# Altium schematic sheet RFID Reader.SchDoc
size B; Organization: MASA; SheetNumber: 2; SheetTotal: 7
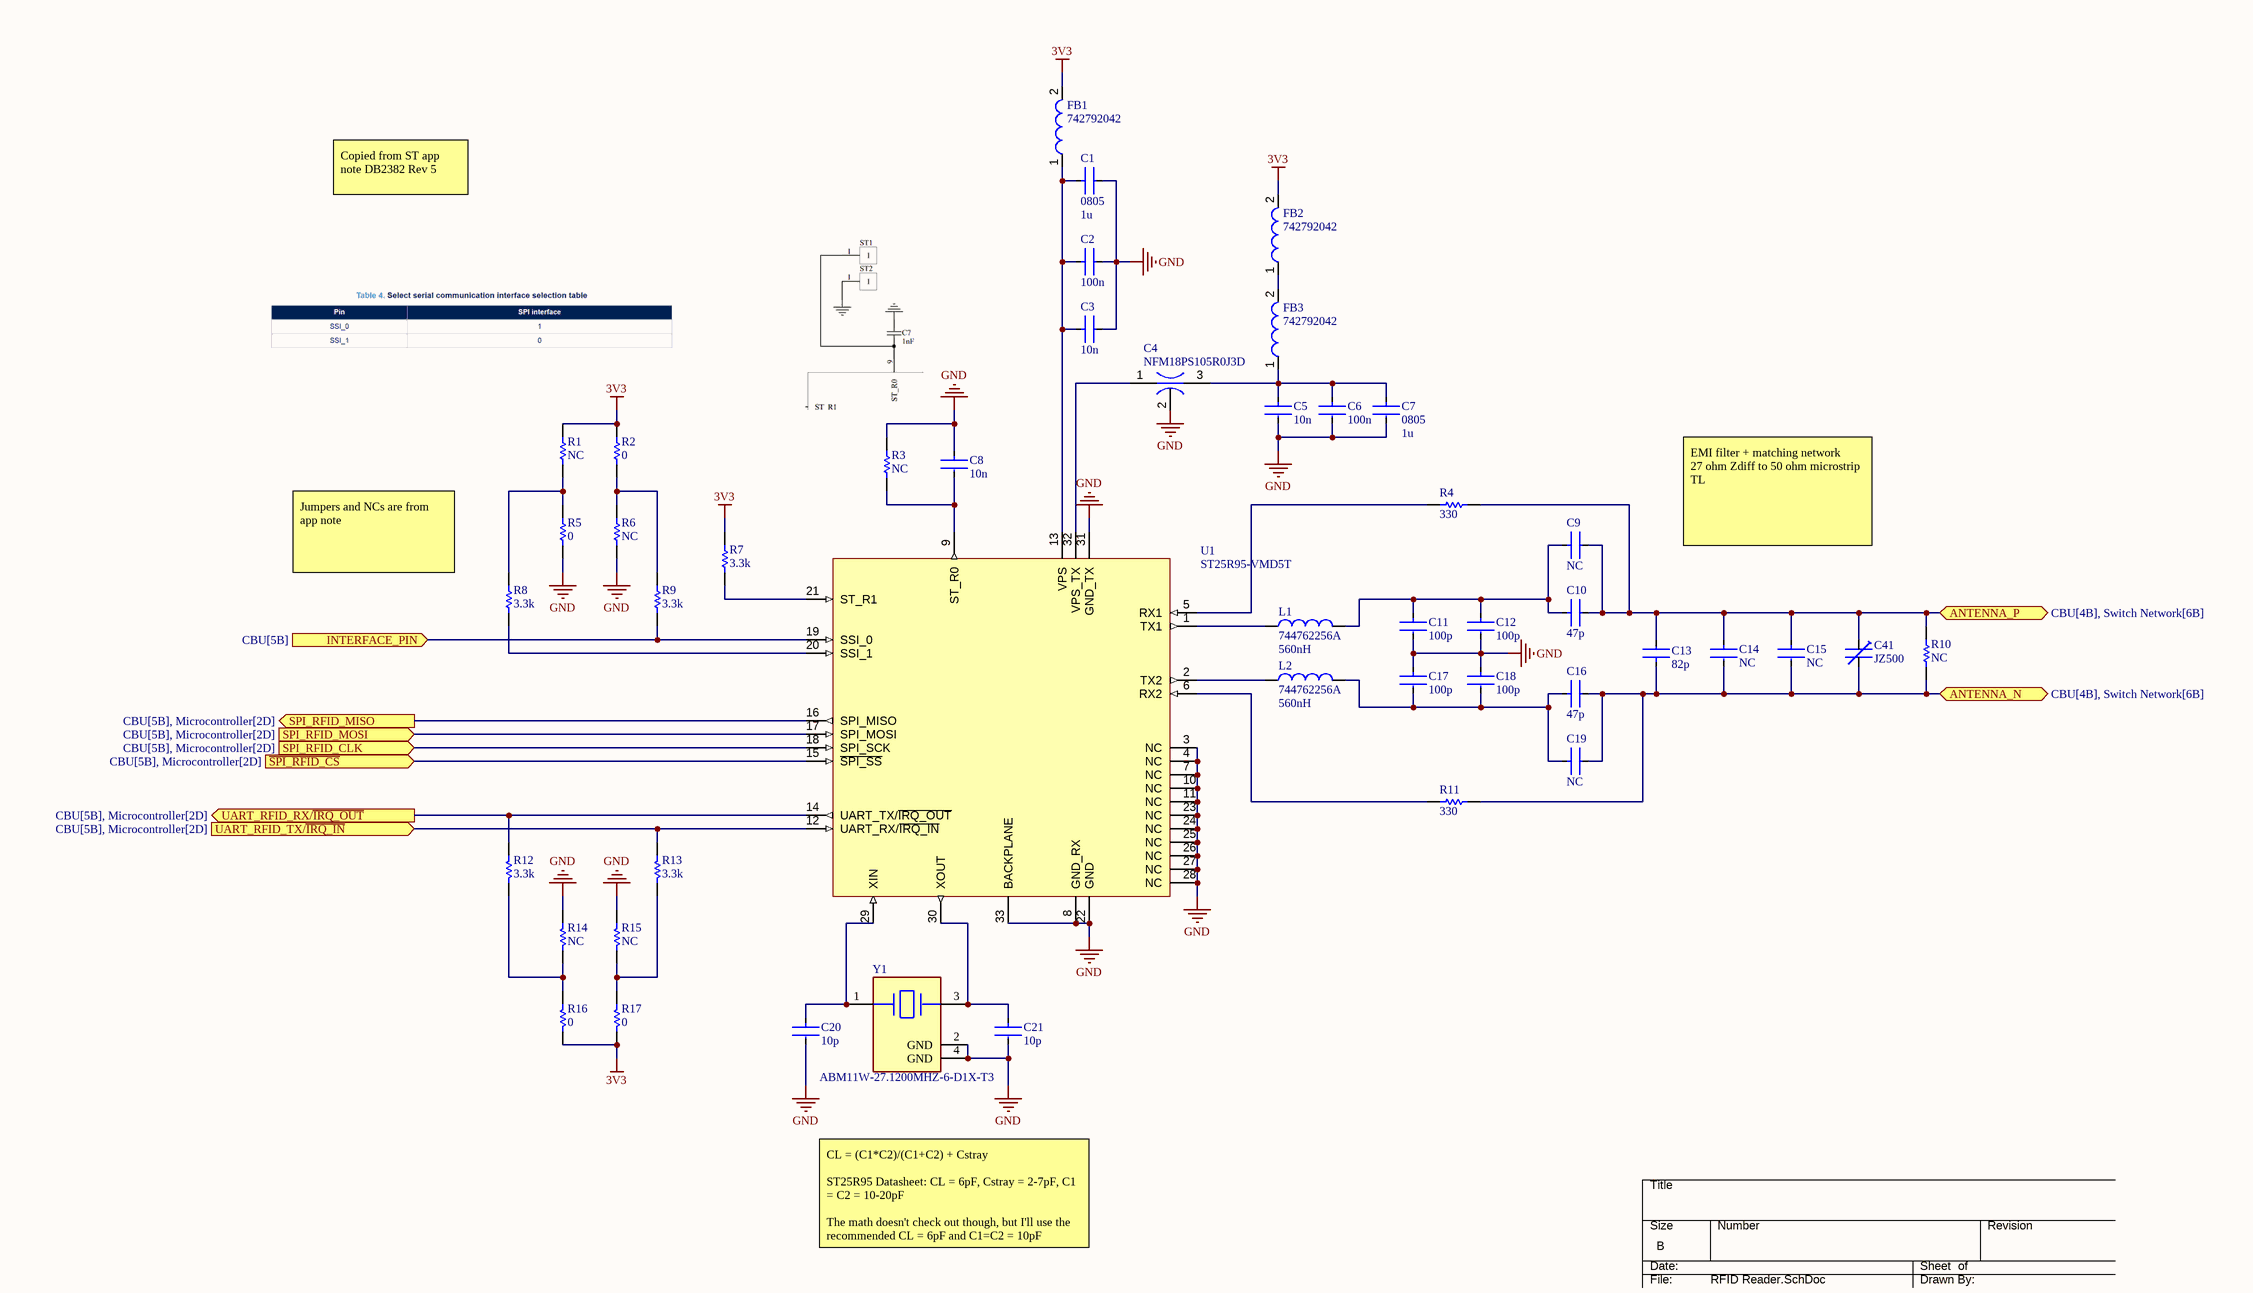
[diagram p0: RFID Reader.SchDoc]

## Parts
C1  value 1u  Package: 0805  [FP-0805-Capacitor-CL21-IPC_B]  (hidden comment: Ceramic Capacitor 0805)
C2  value 100n  [FP-0603-Capacitor-CL10-IPC_B]  (hidden comment: Ceramic Capacitor 0603)
C3  value 10n  [FP-0603-Capacitor-CL10-IPC_B]  (hidden comment: Ceramic Capacitor 0603)
C4  NFM18PS105R0J3D  [FP-NFM18-0_1-e0_05_0_35-MFG]
C5  value 10n  [FP-0603-Capacitor-CL10-IPC_B]  (hidden comment: Ceramic Capacitor 0603)
C6  value 100n  [FP-0603-Capacitor-CL10-IPC_B]  (hidden comment: Ceramic Capacitor 0603)
C7  value 1u  Package: 0805  [FP-0805-Capacitor-CL21-IPC_B]  (hidden comment: Ceramic Capacitor 0805)
C8  value 10n  [FP-0603-Capacitor-CL10-IPC_B]  (hidden comment: Ceramic Capacitor 0603)
C9  value NC  [FP-0603-Capacitor-CL10-IPC_B]  (hidden comment: Ceramic Capacitor 0603)
C10  value 47p  [FP-0603-Capacitor-CL10-IPC_B]  (hidden comment: Ceramic Capacitor 0603)
C11  value 100p  [FP-0603-Capacitor-CL10-IPC_B]  (hidden comment: Ceramic Capacitor 0603)
C12  value 100p  [FP-0603-Capacitor-CL10-IPC_B]  (hidden comment: Ceramic Capacitor 0603)
C13  value 82p  [FP-0603-Capacitor-CL10-IPC_B]  (hidden comment: Ceramic Capacitor 0603)
C14  value NC  [FP-0603-Capacitor-CL10-IPC_B]  (hidden comment: Ceramic Capacitor 0603)
C15  value NC  [FP-0603-Capacitor-CL10-IPC_B]  (hidden comment: Ceramic Capacitor 0603)
C16  value 47p  [FP-0603-Capacitor-CL10-IPC_B]  (hidden comment: Ceramic Capacitor 0603)
C17  value 100p  [FP-0603-Capacitor-CL10-IPC_B]  (hidden comment: Ceramic Capacitor 0603)
C18  value 100p  [FP-0603-Capacitor-CL10-IPC_B]  (hidden comment: Ceramic Capacitor 0603)
C19  value NC  [FP-0603-Capacitor-CL10-IPC_B]  (hidden comment: Ceramic Capacitor 0603)
C20  value 10p  [FP-0603-Capacitor-CL10-IPC_B]  (hidden comment: Ceramic Capacitor 0603)
C21  value 10p  [FP-0603-Capacitor-CL10-IPC_B]  (hidden comment: Ceramic Capacitor 0603)
C41  JZ500  [JZXXX_Trim_Capacitor]
FB1  742792042  [742792042]
FB2  742792042  [742792042]
FB3  742792042  [742792042]
L1  744762256A  Inductance: 560nH  [744762256A]
L2  744762256A  Inductance: 560nH  [744762256A]
R1  value NC  [RESC1608X55X25NL10T15]  (hidden comment: RC0603FR-072K2L)
R2  value 0  [RESC1608X55X25NL10T15]  (hidden comment: RC0603FR-072K2L)
R3  value NC  [RESC1608X55X25NL10T15]  (hidden comment: RC0603FR-072K2L)
R4  value 330  [RESC1608X55X25NL10T15]  (hidden comment: RC0603FR-072K2L)
R5  value 0  [RESC1608X55X25NL10T15]  (hidden comment: RC0603FR-072K2L)
R6  value NC  [RESC1608X55X25NL10T15]  (hidden comment: RC0603FR-072K2L)
R7  value 3.3k  [RESC1608X55X25NL10T15]  (hidden comment: RC0603FR-072K2L)
R8  value 3.3k  [RESC1608X55X25NL10T15]  (hidden comment: RC0603FR-072K2L)
R9  value 3.3k  [RESC1608X55X25NL10T15]  (hidden comment: RC0603FR-072K2L)
R10  value NC  [RESC1608X55X25NL10T15]  (hidden comment: RC0603FR-072K2L)
R11  value 330  [RESC1608X55X25NL10T15]  (hidden comment: RC0603FR-072K2L)
R12  value 3.3k  [RESC1608X55X25NL10T15]  (hidden comment: RC0603FR-072K2L)
R13  value 3.3k  [RESC1608X55X25NL10T15]  (hidden comment: RC0603FR-072K2L)
R14  value NC  [RESC1608X55X25NL10T15]  (hidden comment: RC0603FR-072K2L)
R15  value NC  [RESC1608X55X25NL10T15]  (hidden comment: RC0603FR-072K2L)
R16  value 0  [RESC1608X55X25NL10T15]  (hidden comment: RC0603FR-072K2L)
R17  value 0  [RESC1608X55X25NL10T15]  (hidden comment: RC0603FR-072K2L)
U1  ST25R95-VMD5T  [ST25R95-VMD5T]
Y1  ABM11W-27.1200MHZ-6-D1X-T3  [FP-ABM11W-MFG]

## Ports
ANTENNA_N (bidir, see CBU[4B], Switch Network[6B]), ANTENNA_P (bidir, see CBU[4B], Switch Network[6B]), INTERFACE_PIN (in, see CBU[5B]), SPI_RFID_CLK (in, see CBU[5B], Microcontroller[2D]), SPI_RFID_MISO (out, see CBU[5B], Microcontroller[2D]), SPI_RFID_MOSI (in, see CBU[5B], Microcontroller[2D]), UART_RFID_RX/~{IRQ_OUT} (out, see CBU[5B], Microcontroller[2D]), UART_RFID_TX/~{IRQ_IN} (in, see CBU[5B], Microcontroller[2D]), ~{SPI_RFID_CS} (in, see CBU[5B], Microcontroller[2D])

## Nets
3V3: FB1.2 FB2.2 R1.2 R2.2 R7.2 R16.2 R17.2
GND: C1.2 C2.2 C3.2 C4.2(GND) C5.2 C6.2 C7.2 C8.1 C11.2 C12.2 C17.1 C18.1 C20.2 C21.2 R3.1 R5.1 R6.1 R14.1 R15.1 U1.3(NC) U1.4(NC) U1.7(NC) U1.8(GND_RX) U1.10(NC) U1.11(NC) U1.22(GND) U1.23(NC) U1.24(NC) U1.25(NC) U1.26(NC) U1.27(NC) U1.28(NC) U1.31(GND_TX) U1.33(BACKPLANE) Y1.2(GND) Y1.4(GND)
ANTENNA_N: C13.1 C14.2 C15.2 C16.2 C19.2 C41.2 R10.1 R11.1 ; port ANTENNA_N
ANTENNA_P: C9.2 C10.2 C13.2 C14.1 C15.1 C41.1 R4.1 R10.2 ; port ANTENNA_P
INTERFACE_PIN: R9.1 U1.19(SSI_0) ; port INTERFACE_PIN
~{SPI_RFID_CS}: U1.15(~{SPI_SS}) ; port ~{SPI_RFID_CS}
SPI_RFID_CLK: U1.18(SPI_SCK) ; port SPI_RFID_CLK
SPI_RFID_MISO: U1.16(SPI_MISO) ; port SPI_RFID_MISO
SPI_RFID_MOSI: U1.17(SPI_MOSI) ; port SPI_RFID_MOSI
UART_RFID_RX/~{IRQ_OUT}: R12.1 U1.14(UART_TX/~{IRQ_OUT}) ; port UART_RFID_RX/~{IRQ_OUT}
UART_RFID_TX/~{IRQ_IN}: R13.1 U1.12(UART_RX/~{IRQ_IN}) ; port UART_RFID_TX/~{IRQ_IN}
NetC1_1: C1.1 C2.1 C3.1 FB1.1 U1.13(VPS)
NetC4_1: C4.1(Input) U1.32(VPS_TX)
NetC4_3: C4.3(Output) C5.1 C6.1 C7.1 FB3.1
NetC8_2: C8.2 R3.2 U1.9(ST_R0)
NetC9_1: C9.1 C10.1 C11.1 C12.1 L1.2
NetC16_1: C16.1 C17.2 C18.2 C19.1 L2.2
NetC20_1: C20.1 U1.29(XIN) Y1.1
NetC21_1: C21.1 U1.30(XOUT) Y1.3
NetFB2_1: FB2.1 FB3.2
NetL1_1: L1.1 U1.1(TX1)
NetL2_1: L2.1 U1.2(TX2)
NetR1_1: R1.1 R5.2 R8.2
NetR2_1: R2.1 R6.2 R9.2
NetR4_2: R4.2 U1.5(RX1)
NetR7_1: R7.1 U1.21(ST_R1)
NetR8_1: R8.1 U1.20(SSI_1)
NetR11_2: R11.2 U1.6(RX2)
NetR12_2: R12.2 R14.2 R16.1
NetR13_2: R13.2 R15.2 R17.1

## Notes on the sheet
- Copied from ST app note DB2382 Rev 5
- Jumpers and NCs are from app note
- EMI filter + matching network
  27 ohm Zdiff to 50 ohm microstrip TL
- CL = (C1*C2)/(C1+C2) + Cstray
  ST25R95 Datasheet: CL = 6pF, Cstray = 2-7pF, C1 = C2 = 10-20pF
  The math doesn't check out though, but I'll use the recommended CL = 6pF and C1=C2 = 10pF
- DWG. NO.
- REV.
- SHT.
- THIS DOCUMENT AND THE DATA DISCLOSED HEREIN OR HEREWITH IS THE PROPERTY OF ALTIUM LIMITED AND MAY BE FREELY DISTRIBUTED IN WHOLE. NO RIGHTS ARE RESERVED OR EXPRESS OR IMPLIED WARANTEE GIVEN.
- REVISION
- DESCRIPTION
- DATE
- APPROVED
- ENG:
- APPROVALS
- PROJECT
- DSN:
- CHK:
- REFERENCE DOCUMENTS
- PROJECT REVISION:
- TITLE
- DOCUMENT REVISION:
- DESIGN ITEM:
- BOM:
- FAB DWG:
- PCB DWG:
- ASSY DWG:
- SCALE:
- SIZE
- B
- CAGE CODE
- FILE NAME
- DWG NO.
- SHEET
- OF
- REV

## Library data of the parts
C1 C7 = Ceramic Capacitor 0805: CAP CER 50V X7R 0805; Manufacturer: KEMET; Manufacturer Part Number: C0603C104K5RACTU; Tolerance: 0.1; Temperature Coefficient: 30ppm/°C; Automotive Grade: Grade 1; Temperature: -55°C to +125°C; RoHS: TRUE; Material: Ceramic; Temperature Range High: +125°C; Lead Free: Yes; Octopart: https://octopart.com/c0603c104k5ractu-kemet-139244; Digikey Description: CAP CER 0.1UF 50V X7R 0603; Category: Cap; ComponentLink2Description: Datasheet; Temperature Range Low: -55°C; Device Class L1: Passive Components; Voltage Rating: 50 V; Automotive: Yes; Device Class L3: Ceramic Capacitors; ComponentLink2URL: https://api.kemet.com/component-edge/download/datasheet/C0603C100J5GACAUTO.pdf; Device Class L2: Capacitors; Temperature Characteristic: X7R; Height: 0.87mm; Supplier 1: Arrow Electronics; Supplier Part Number 1: CL21B105KBFNNNG
C2 C3 C5 C6 C8-C21 = Ceramic Capacitor 0603: CAP CER 50V X7R 0603; Manufacturer: KEMET; Manufacturer Part Number: C0603C104K5RACTU; Tolerance: 0.1; Temperature Coefficient: 30ppm/°C; Automotive Grade: Grade 1; Temperature: -55°C to +125°C; RoHS: TRUE; Material: Ceramic; Temperature Range High: +125°C; Lead Free: Yes; Octopart: https://octopart.com/c0603c104k5ractu-kemet-139244; Digikey Description: CAP CER 0.1UF 50V X7R 0603; Category: Cap; Package: C0603C-CF; ComponentLink2Description: Datasheet; Temperature Range Low: -55°C; Device Class L1: Passive Components; Voltage Rating: 50 V; Automotive: Yes; Device Class L3: Ceramic Capacitors; ComponentLink2URL: https://api.kemet.com/component-edge/download/datasheet/C0603C100J5GACAUTO.pdf; Device Class L2: Capacitors; Temperature Characteristic: X7R; Height: 0.87mm; Supplier 1: Mouser; Supplier Part Number 1: 80-C0201C120K3G
C4 = NFM18PS105R0J3D: Large Current 3 Terminals Low ESL Chip Multilayer Ceramic Capacitors for General Purpose, 0603, 1uF, 20%, 6.3V; Current Rating: 2A; DC Resistance (DCR): 30mR; Insulation Resistance: 500MR; Max Voltage Rating (DC): 6.3V; Voltage: 6.3V; Weight: 7.1E-05oz; Height: 0.6mm; Lead Free: Lead Free; REACH SVHC: No SVHC; Max Operating Temperature: 105°C; Min Operating Temperature: -55°C; Mount: Surface Mount; Capacitance: 1uF; Width: 0.8mm; Radiation Hardening: No; Max Current Rating: 2A; Case Code (Imperial): 0603; Voltage Rating (DC): 6.3V; Length: 1.6mm; Case/Package: 0603; Case Code (Metric): 1608; Package Quantity: 1; Tolerance: 20%; Current: 2A; Packaging: Tape and Reel; Depth: 0.8mm; Voltage Rating: 6.3V; Termination: Flat; Supplier 1: Arrow Electronics; Supplier Part Number 1: NFM18PS105R0J3D
C41 = JZ500: 8 ~ 50pF Trimmer Capacitor 125 V Top Surface Mount
FB1-FB3 = 742792042: SMD EMI Suppression Ferrite Bead WE-CBF, Z = 600 Ohm; Impedance: 600 Ohm; PackageDescription: Chip Inductor, 2-Leads, Body 2.0 x 1.2 mm; ComponentLink1Description: Manufacturer Link; PackageVersion: 2005; PackageReference: SMD-0805; ComponentLink2URL: http://www.we-online.de/katalog/media/pdf/742792042.pdf; ComponentLink2Description: Datasheet; DatasheetVersion: Dec-2005; ComponentLink1URL: http://www.we-online.com; Supplier 1: Digi-Key; Supplier Part Number 1: 732-4642-1-ND
L1 L2 = 744762256A: 744762256A General Purpose Inductor, 0.56uH, 5%, 1 Element, Ceramic-Core, SMD, 1008; NexarPartId: 23392503; Max DC Current: 310mA; Frequency: 100MHz; Resistance: 1.17Ω; DC Resistance (DCR): 1.5Ω; Q Factor: 45; Shielding: Unshielded; Self Resonant Frequency: 430MHz; Inductance Tolerance: 5%; Packaging: Digi-Reel®; Case/Package: 1008; Core Material: Ceramic; Composition: Ceramic, Wirewound; Material: Ceramic; Termination: SMD/SMT; Case Code (Imperial): 1008; Weight: 20mg; Max Operating Temperature: 125°C; Current Rating: 310mA; Length: 2.5mm; Min Operating Temperature: -40°C; Height - Seated (Max): 1.905mm; Height: 1.6mm; Series Resistance: 1.5Ω; RoHS: Compliant; Ambient Temperature Range Low: -40°C; Width: 2mm; Mount: Surface Mount; Ambient Temperature Range High: 110°C; Test Frequency: 100MHz; Case Code (Metric): 2520; Tolerance: 5%; REACH SVHC: Unknown; Supplier 1: Digi-Key; Supplier Part Number 1: 732-1829-1-ND
R1-R17 = Resistor 0603: Thick Film Resistor, 2.2 KOhm, 100 mW, 50 V, +/- 1%, -55 to 155 degC, 2-Pin SMD (0603), RoHS, Tape and Reel; Manufacturer: Yageo; Temperature Coefficient: 100PPM/C; Voltage Rating: 50V; Power Rating: 100mW; Tolerance: 1%; Datasheet Version: Rev. 7, 05/2017; Case Code - mm: 1608; Series: RC; Mounting Technology: SurfaceMount; Package Description: 2-Pin Surface Mount Device, Body 1.6 x 0.8 mm; Case Code - in: 0603; Package Reference: 0603; Product: ThickFilmResistorsGeneralPurpose; Manufacturer URL: http://www.yageo.com/; Termination Style: SMD/SMT; Operating Temperature Range: -55Cto+155C; Datasheet URL: http://www.yageo.com/documents/recent/PYu-RC_Group_51_RoHS_L_7.pdf; Packaging: Reel
U1 = ST25R95-VMD5T: RFID Reader IC 13.56MHz FeliCa, ISO 14443, ISO 15693, ISO 18000-3, MIFARE, NFC SPI 2.7V ~ 5.5V 32-VFQFN Exposed Pad; Supplier 1: Mouser; Supplier Part Number 1: 511-ST25R95-VMD5T
Y1 = ABM11W-27.1200MHZ-6-D1X-T3: Crystal 27.12MHz ±10ppm 6pF SMD-4 2mm x 1.6mm; ESR (Equivalent Series Resistance): 100R; Frequency Stability: 20ppm; Load Capacitance: 6pF; Case/Package: SMD/SMT; Min Operating Temperature: -40°C; Max Operating Temperature: 85°C; Frequency: 27.12MHz; Frequency Tolerance: 10ppm; Mount: Surface Mount; Packaging: Tape and Reel; Supplier 1: Digi-Key; Supplier Part Number 1: 535-13879-1-ND